# EAGLE schematic communicator_v2p1 (EAGLE 7.6.0)
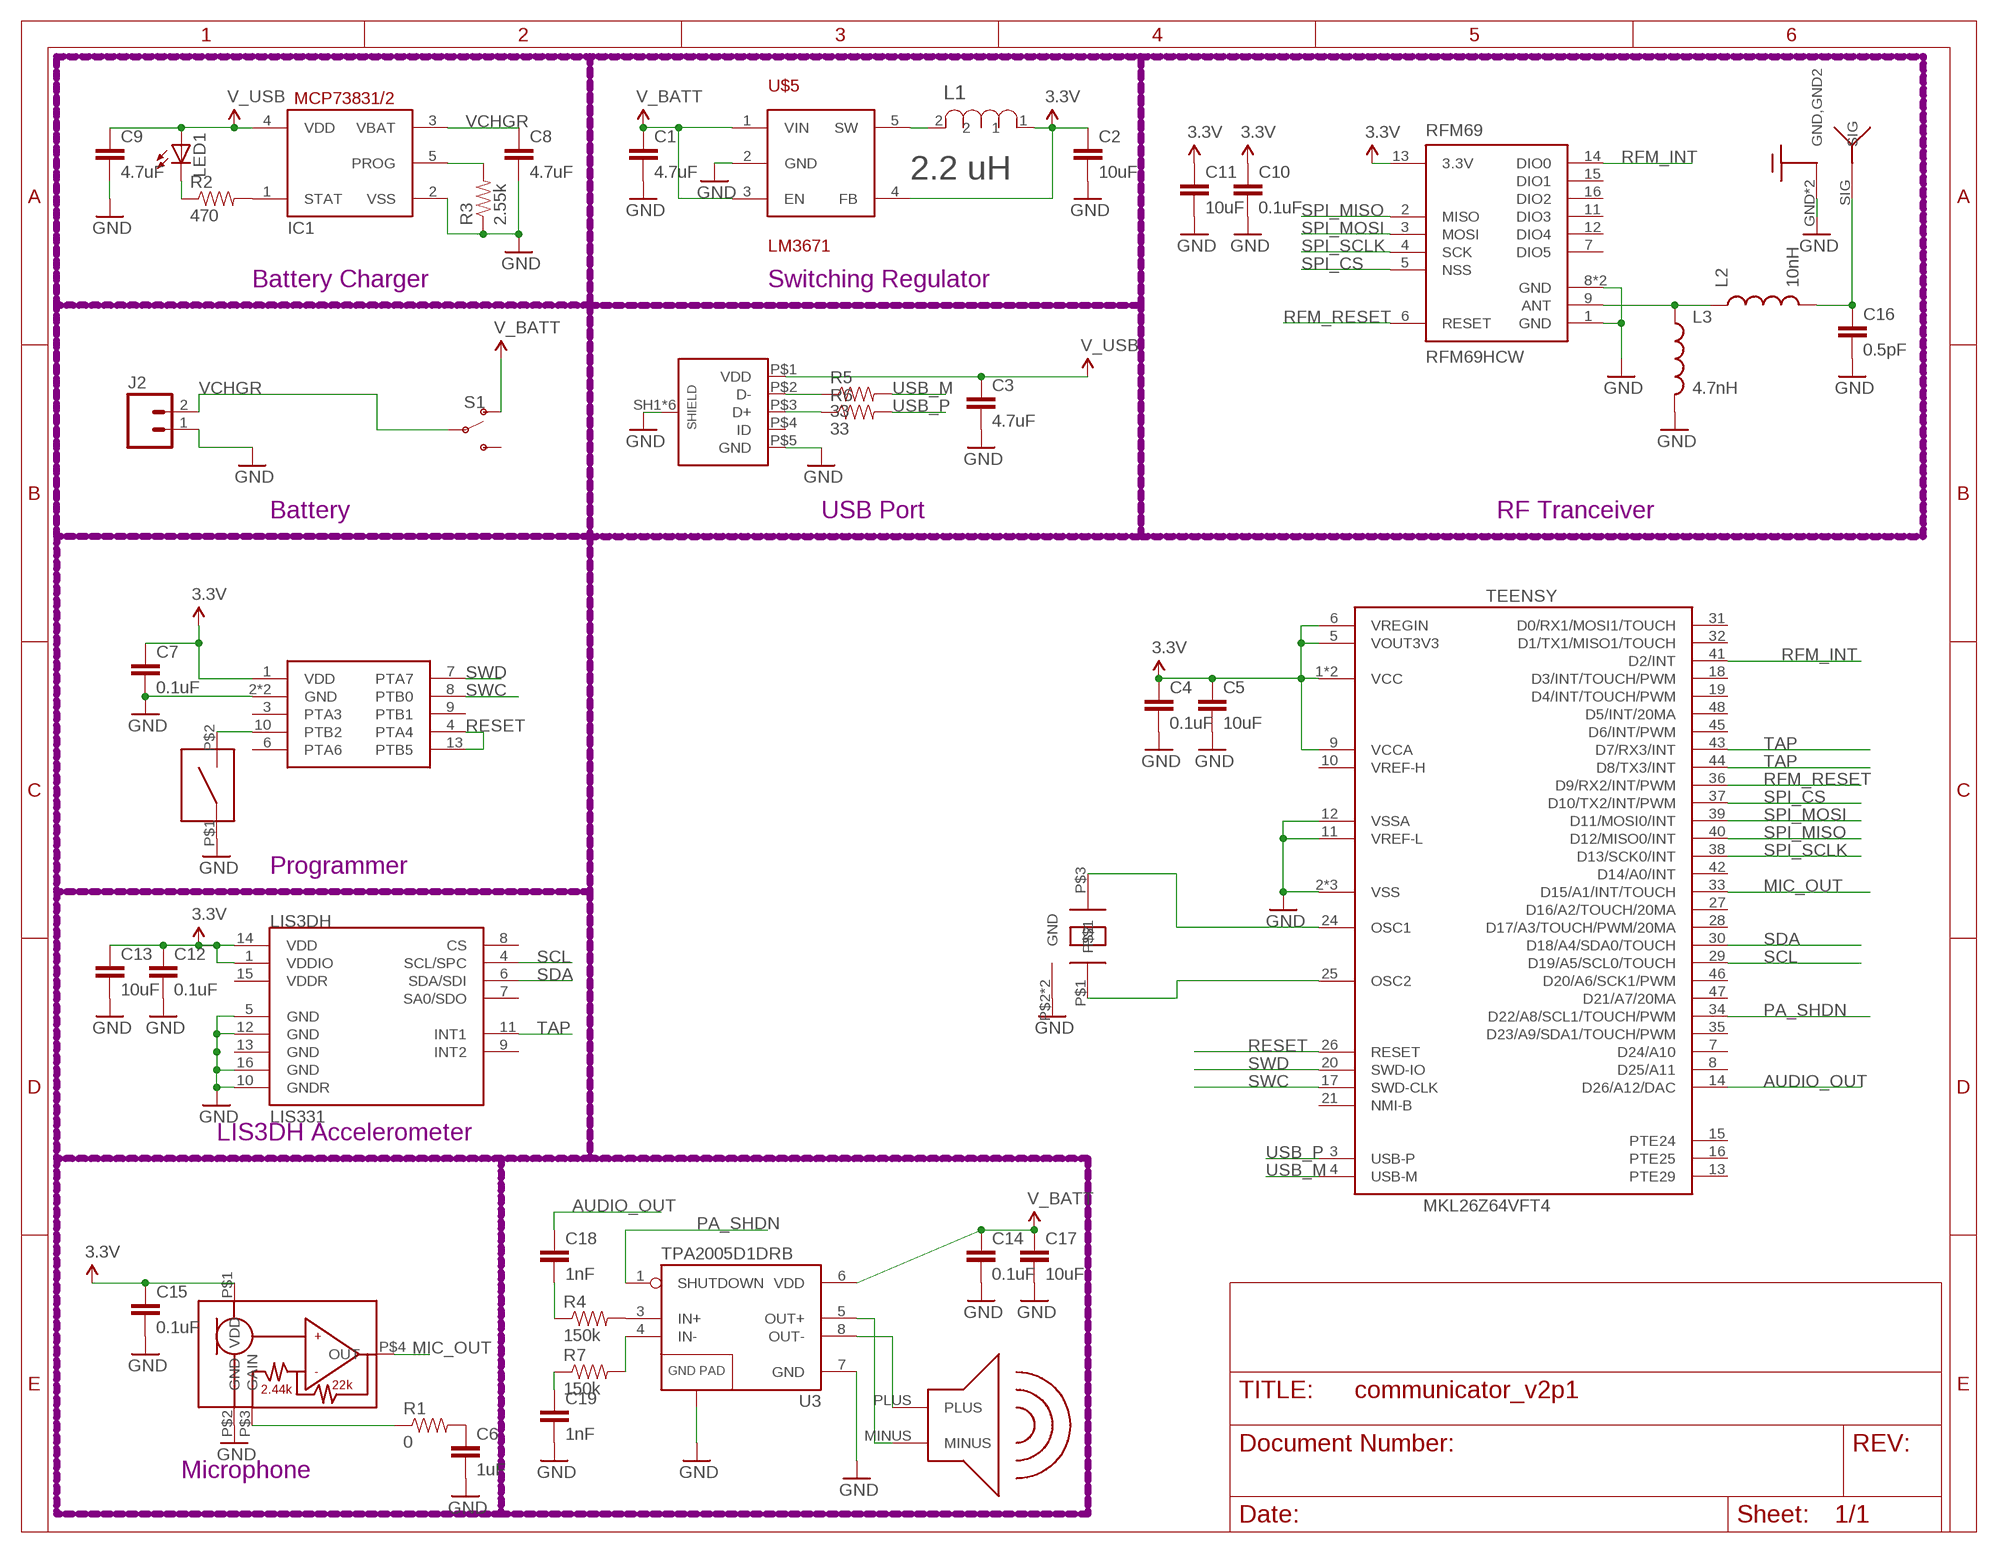
[diagram p0: schematic, sheet 1]

## Parts
3X3MM1  CURRENT_BOOTLOADER3X3MM  [QFN50P300X300X100-17N]
C1  4.7uF  0.1UF-25V(+80/-20%)(0603)  [0603-CAP]
C2  10uF  2.2UF-10V-20%(0603)  [0603-CAP]
C3  4.7uF  2.2UF-10V-20%(0603)  [0603-CAP]
C4  0.1uF  0.1UF-25V(+80/-20%)(0603)  [0603-CAP]
C5  10uF  10UF-6.3V-20%(0603)  [0603-CAP]
C6  1uF  0.1UF-25V(+80/-20%)(0603)  [0603-CAP]
C7  0.1uF  0.1UF-25V(+80/-20%)(0603)  [0603-CAP]
C8  4.7uF  4.7UF-6.3V-10%(0603)0603  [0603-CAP]
C9  4.7uF  4.7UF-6.3V-10%(0603)0603  [0603-CAP]
C10  0.1uF  0.1UF-25V(+80/-20%)(0603)  [0603-CAP]
C11  10uF  10UF-6.3V-20%(0603)  [0603-CAP]
C12  0.1uF  0.1UF-25V(+80/-20%)(0603)  [0603-CAP]
C13  10uF  10UF-6.3V-20%(0603)  [0603-CAP]
C14  0.1uF  0.1UF-25V(+80/-20%)(0603)  [0603-CAP]
C15  0.1uF  0.1UF-25V(+80/-20%)(0603)  [0603-CAP]
C16  0.5pF  0.75PF-50V(-/+.25PF)(0603)  [0603-CAP]
C17  10uF  10UF-6.3V-20%(0603)  [0603-CAP]
C18  1nF  0.1UF-25V(+80/-20%)(0603)  [0603-CAP]
C19  1nF  0.1UF-25V(+80/-20%)(0603)  [0603-CAP]
IC1  MCP73831/OT  [SOT23-5L]
J2  M02PTH  [1X02]
L1  2.2 uH  PM1210-2R2J-RC  [INDC3225X22N]
L2  10nH  INDUCTOR0603  [0603]
L3  4.7nH  INDUCTOR0603  [0603]
LED1  LEDCHIPLED_0805  [CHIPLED_0805]
LIS3DH  LIS331  [LGA16-3MM]
R1  0  33OHM1/10W1%(0603)  [0603-RES]
R2  470  470OHM1/10W1%(0603)  [0603-RES]
R3  2.55k  2.55KOHM-1/10W-1%(0603)  [0603-RES]
R4  150k  33OHM1/10W1%(0603)  [0603-RES]
R5  33  33OHM1/10W1%(0603)  [0603-RES]
R6  33  33OHM1/10W1%(0603)  [0603-RES]
R7  150k  33OHM1/10W1%(0603)  [0603-RES]
RFM69  RFM69HCW  [RFM69HCW-XXXS2]
S1  SWITCH-SPDT-SMD-RIGHT-ANGLE  [SWITCH_SPST_SMD_A]
TEENSY  MKL26Z64VFT4  [QFN50P700X700X100-49N]
U3  TPA2005D1DRB  [QFN-8_PAD]
U$1  ANTENNA_915MHZ  [ANTENNA_915MHZ]
U$2  MICROPHONE  [SPU0414HR5H-SB]
U$3  SPEAKER  [PSR1511N08S3K]
U$4  KXT131LHS  [KXT131LHS]
U$5  LM3671  [SOT23-5]
U$8  MICRO_USB_B  [MICRO_USB_B]
U$9  TSX-3225  [TSX-3225]

## Nets
3.3V: 3X3MM1.1(VDD) C2.1 C4.1 C5.1 C7.1 C10.1 C11.1 C12.1 C13.1 C15.1 L1.1 LIS3DH.1(VDDIO) LIS3DH.14(VDD) RFM69.13(3.3V) TEENSY.1(VCC) TEENSY.5(VOUT3V3) TEENSY.6(VREGIN) TEENSY.9(VCCA) TEENSY.22(VCC) U$2.P$1(VDD) U$5.4(FB)
AUDIO_OUT: C18.1 TEENSY.14(D26/A12/DAC)
GND: 3X3MM1.2(GND) 3X3MM1.17(GND) C1.2 C2.2 C3.2 C4.2 C5.2 C6.2 C7.2 C8.2 C9.2 C10.2 C11.2 C12.2 C13.2 C14.2 C15.2 C16.2 C17.2 C19.2 IC1.2(VSS) J2.1 L3.2 LIS3DH.5(GND) LIS3DH.10(GNDR) LIS3DH.12(GND) LIS3DH.16(GND) R3.1 RFM69.1(GND) RFM69.8(GND) RFM69.10(GND) TEENSY.2(VSS) TEENSY.11(VREF-L) TEENSY.12(VSSA) TEENSY.23(VSS) TEENSY.49(VSS) U3.7(GND) U3.9(GND) U3.10(GND) U3.11(GND) U3.12(GND) U3.13(GND) U$1.GND2(GND,GND2) U$1.GND(GND,GND2) U$2.P$2(GND) U$4.P$1 U$5.2(GND) U$8.P$5(GND) U$8.SH1(SHIELD) U$8.SH2(SHIELD) U$8.SH3(SHIELD) U$8.SH4(SHIELD) U$8.SH5(SHIELD) U$8.SH6(SHIELD) U$9.P$2(GND) U$9.P$4(GND)
MIC_OUT: TEENSY.33(D15/A1/INT/TOUCH) U$2.P$4(OUT)
N$1: R1.1 U$2.P$3(GAIN)
N$2: IC1.1(STAT) R2.2
N$3: C6.1 R1.2
N$4: C16.1 L2.2 U$1.SIG
N$5: TEENSY.24(OSC1) U$9.P$3
N$6: TEENSY.25(OSC2) U$9.P$1
N$7: U3.5(OUT+) U$3.MINUS
N$8: L2.1 L3.1 RFM69.9(ANT)
N$9: 3X3MM1.10(PTB2) U$4.P$2
N$10: U3.8(OUT-) U$3.PLUS
N$11: R4.2 U3.3(IN+)
N$12: R7.2 U3.4(IN-)
N$13: C18.2 R4.1
N$14: R5.1 U$8.P$2(D-)
N$15: R6.1 U$8.P$3(D+)
N$16: C19.1 R7.1
N$21: IC1.5(PROG) R3.2
N$25: LED1.C R2.1
N$31: L1.2 U$5.5(SW)
PA_SHDN: TEENSY.34(D22/A8/SCL1/TOUCH/PWM) U3.1(SHUTDOWN)
RESET: 3X3MM1.4(PTA4) 3X3MM1.13(PTB5) TEENSY.26(RESET)
RFM_INT: RFM69.14(DIO0) TEENSY.41(D2/INT)
RFM_RESET: RFM69.6(RESET) TEENSY.36(D9/RX2/INT/PWM)
SCL: LIS3DH.4(SCL/SPC) TEENSY.29(D19/A5/SCL0/TOUCH)
SDA: LIS3DH.6(SDA/SDI) TEENSY.30(D18/A4/SDA0/TOUCH)
SPI_CS: RFM69.5(NSS) TEENSY.37(D10/TX2/INT/PWM)
SPI_MISO: RFM69.2(MISO) TEENSY.40(D12/MISO0/INT)
SPI_MOSI: RFM69.3(MOSI) TEENSY.39(D11/MOSI0/INT)
SPI_SCLK: RFM69.4(SCK) TEENSY.38(D13/SCK0/INT)
SWC: 3X3MM1.8(PTB0) TEENSY.17(SWD-CLK)
SWD: 3X3MM1.7(PTA7) TEENSY.20(SWD-IO)
TAP: LIS3DH.11(INT1) TEENSY.43(D7/RX3/INT) TEENSY.44(D8/TX3/INT)
USB_M: R5.2 TEENSY.4(USB-M)
USB_P: R6.2 TEENSY.3(USB-P)
V_BATT: C1.1 C14.1 C17.1 S1.1(O) U3.6(VDD) U$5.1(VIN) U$5.3(EN)
V_USB: C3.1 C9.1 IC1.4(VDD) LED1.A U$8.P$1(VDD)
VCHGR: C8.1 IC1.3(VBAT) J2.2 S1.2(P)
Unconnected: 3X3MM1.3(PTA3) 3X3MM1.6(PTA6) 3X3MM1.9(PTB1) LIS3DH.7(SA0/SDO) LIS3DH.8(CS) LIS3DH.9(INT2) LIS3DH.13(GND) LIS3DH.15(VDDR) RFM69.7(DIO5) RFM69.11(DIO3) RFM69.12(DIO4) RFM69.15(DIO1) RFM69.16(DIO2) S1.3(S) TEENSY.7(D24/A10) TEENSY.8(D25/A11) TEENSY.10(VREF-H) TEENSY.13(PTE29) TEENSY.15(PTE24) TEENSY.16(PTE25) TEENSY.18(D3/INT/TOUCH/PWM) TEENSY.19(D4/INT/TOUCH/PWM) TEENSY.21(NMI-B) TEENSY.27(D16/A2/TOUCH/20MA) TEENSY.28(D17/A3/TOUCH/PWM/20MA) TEENSY.31(D0/RX1/MOSI1/TOUCH) TEENSY.32(D1/TX1/MISO1/TOUCH) TEENSY.35(D23/A9/SDA1/TOUCH/PWM) TEENSY.42(D14/A0/INT) TEENSY.45(D6/INT/PWM) TEENSY.46(D20/A6/SCK1/PWM) TEENSY.47(D21/A7/20MA) TEENSY.48(D5/INT/20MA) U$8.P$4(ID)

## Notes on the sheet
- Battery Charger | Switching Regulator
- Battery | USB Port | RF Tranceiver
- Programmer
- LIS3DH Accelerometer
- Microphone

## Library data of the parts
3X3MM1 = Teensy_DIY_v1.0:CURRENT_BOOTLOADER: MKL02Z32 and MKL04Z32 bootloader chips for Teensy LC (MKL26) and Teensy 3.2 (MKL20D256) processors. Remember, all power supply pins need to be decoupled! Also note the connections that Paul recommends on his bootloader page.
C1 C6 C18 C19 = SparkFun-Capacitors:0.1UF-25V(+80/-20%)(0603): CAP-00810 Ceramic Standard decoupling cap; PROD_ID: CAP-00810; VALUE: 0.1uF
C2 C3 = SparkFun-Capacitors:2.2UF-10V-20%(0603): CAP-07888; PROD_ID: CAP-07888; VALUE: 2.2uF
C4 C7 C10 C12 C14 C15 = SparkFun-Capacitors:0.1UF-25V(+80/-20%)(0603): CAP-00810 Ceramic Standard decoupling cap; PROD_ID: CAP-00810
C5 C11 C13 C17 = SparkFun-Capacitors:10UF-6.3V-20%(0603): CAP-11015; PROD_ID: CAP-11015
C8 C9 = SparkFun-Capacitors:4.7UF-6.3V-10%(0603): CAP-08280; PROD_ID: CAP-08280
C16 = SparkFun-Capacitors:0.75PF-50V(-/+.25PF)(0603): CAP-07878; PROD_ID: CAP-07878; VALUE: 0.75pF
IC1 = adafruit:MCP73831: MCP73831/2 Miniature Single-Cell, Fully Integrated Li-Ion, Li-Polymer Charge Management Controllers. Nice and small simple lipoly charge controller, with adjustable current and status output (LED) http://www.ladyada.net/library/pcb/eaglelibrary.html
J2 = SparkFun-Connectors:M02: Standard 2-pin 0.1" header. Use with - straight break away headers ( PRT-00116) - right angle break away headers (PRT-00553) - swiss pins (PRT-00743) - machine pins (PRT-00117) - female headers (PRT-00115) Molex polarized connector foot print use with: PRT-08233 with associated crimp pins and housings. 2.54_SCREWTERM for use with PRT-10571. 3.5mm Screw Terminal footprints for PRT-08084 5mm Screw Terminal footprints for use with PRT-08432
L1 = Bourns_By_element14_Batch_1:PM1210-2R2J-RC: CHIP INDUCTOR, 2.2UH 320MA 5% 75MHZ; MPN: PM1210-2R2J-RC; OC_FARNELL: 1180471; OC_NEWARK: 63K3102; SUPPLIER: BOURNS; TOLERANCE: ±5 %
L2 L3 = SparkFun-Passives:INDUCTOR: Inductors Basic Inductor/Choke - 0603 and 1206. Footprints are not proven and vary greatly between part numbers. INDUCTOR POWER 3.3UH 4.0A SMD 0.197" L x 0.197" W x 0.177" H (5.00mm x 5.00mm x 4.50mm)
LED1 = adafruit:LED: LED OSRAM: - CHIPLED LG R971, LG N971, LY N971, LG Q971, LY Q971, LO R971, LY R971 LH N974, LH R974 LS Q976, LO Q976, LY Q976 LO Q996 - Hyper CHIPLED LW Q18S LB Q993, LB Q99A, LB R99A - SideLED LS A670, LO A670, LY A670, LG A670, LP A670 LB A673, LV A673, LT A673, LW A673 LH A674 LY A675 LS A676, LA A676, LO A676, LY A676, LW A676 LS A679, LY A679, LG A679 - Hyper Micro SIDELED® LS Y876, LA Y876, LO Y876, LY Y876 LT Y87S - SmartLED LW L88C, LW L88S LB L89C, LB L89S, LG L890 LS L89K, LO L89K, LY L89K LS L896, LA L896, LO L896, LY L896 - TOPLED LS T670, LO T670, LY T670, LG T670, LP T670 LSG T670, LSP T670, LSY T670, LOP T670, LYG T670 LG T671, LOG T671, LSG T671 LB T673, LV T673, LT T673, LW T673 LH T674 LS T676, LA T676, LO T676, LY T676, LB T676, LH T676, LSB T676, LW T676 LB T67C, LV T67C, LT T67C, LS T67K, LO T67K, LY T67K, LW E67C LS E67B, LA E67B, LO E67B, LY E67B, LB E67C, LV E67C, LT E67C LW T67C LS T679, LY T679, LG T679 LS T770, LO T770, LY T770, LG T770, LP T770 LB T773, LV T773, LT T773, LW T773 LH T774 LS E675, LA E675, LY E675, LS T675 LS T776, LA T776, LO T776, LY T776, LB T776 LHGB T686 LT T68C, LB T68C - Hyper Mini TOPLED® LB M676 - Mini TOPLED Santana® LG M470 LS M47K, LO M47K, LY M47K Source: http://www.osram.convergy.de/
LIS3DH = SparkFun-Sensors:LIS331: 3-axis 6/12/24g SPI/I2C accelerometer
R1 R4 R7 = SparkFun-Resistors:33OHM1/10W1%(0603): RES-08270; PROD_ID: RES-08270; VALUE: 33
R2 = SparkFun-Resistors:470OHM1/10W1%(0603): RES-07869; PROD_ID: RES-07869
R3 = SparkFun-Resistors:2.55KOHM-1/10W-1%(0603): RES-11227; PROD_ID: RES-11227
R5 R6 = SparkFun-Resistors:33OHM1/10W1%(0603): RES-08270; PROD_ID: RES-08270
RFM69 = SparkFun-RF:RFM69H; PROD_ID: IC-11997, IC-12053
S1 = SparkFun-Switches:SWITCH-SPDT: Single Pole, Double Throw (SPDT) Switch Single-pole, double-throw (SPDT) switch. Variant Overview SMD-AYZ0202 Surface Mount DPDT Switch <https://www.sparkfun.com/products/597> (COM-00597) Used on e.g. LilyPad Arduino USB - ATmega32U4 Board <https://www.sparkfun.com/products/12049> PTH-11.6X4.0MM SPDT Mini Power Switch <https://www.sparkfun.com/products/102> (COM-00102) Used on e.g. SparkFun Simon Says - Through-Hole Soldering Kit <https://www.sparkfun.com/products/10547> (KIT-10547) PTH-11.6X4.0MM-KIT KIT version of SPDT Mini Power Switch - Simplifies soldering by removing tStop of switch pins - only one side can be soldered. PTH-11.6X4.0MM-LOCK LOCK version of SPDT Mini Power Switch - Offset pins hold switch in place for easier soldering. SMD-RIGHT-ANGLE Surface Mount Right Angle Switch <https://www.sparkfun.com/products/10860> (COM-10860) Used on e.g. SparkFun ESP8266 Thing <https://www.sparkfun.com/products/13231>; PROD_ID: SWCH-10651; SF_SKU: COM-10860
TEENSY = Teensy_DIY_v1.0:MKL26Z64VFT4: This is a Teensy LC MCU based on the MKL26Z64VFT4. Note: To enable USB, you need to have 3.3V at VOUT3V3. If you want to supply 3.3V power externally, provide it to VCC, VREGIN, and VOUT3V3. The Voltage Regulator will go into dropout mode.
U3 = SparkFun-AnalogIC:TPA2005D1: 1.4W MONO CLASS-D AUDIO POWER AMPLIFIER The TPA2005D1 is a 1.4-W high efficiency filter-free class-D audio power amplifier in a BGA, QFN, or MSOP package that requires only three external components. Datasheet: http://focus.ti.com/lit/ds/symlink/tpa2005d1.pdf 1.4 W Into 8 ? From a 5V Supply at THD = 10% (Typ) Maximum Battery Life and Minimum Heat Efficiency With an 8-? Speaker: 84% at 400 mW, 79% at 100 mW 2.8-mA Quiescent Current 0.5-mA Shutdown Current Ideal for Wireless or Cellular Handsets and PDAs Capable of Driving an 8-? Speaker (2.5 V ? VDD ? 5.5 V) and a 4-? Speaker (2.5 V ? VDD ? 4.2 V) Only Three External Components Optimized PWM Output Stage Eliminates LC Output Filter Internally Generated 250-kHz Switching Frequency Eliminates Capacitor and Resistor Improved PSRR (-71 dB at 217 Hz) and Wide Supply Voltage (2.5 V to 5.5 V) Eliminates Need for a Voltage Regulator Fully Differential Design Reduces RF Rectification and Eliminates Bypass Capacitor Improved CMRR Eliminates Two Input Coupling Capacitors
U$1 = prototype:ANTENNA_915MHZ
U$2 = prototype:MICROPHONE
U$3 = prototype:SPEAKER
U$4 = prototype:KXT131LHS
U$5 = texas-custom:LM3671: Texas Instruments LM3671, LM3671Q 2MHz, 600mA Step-Down DC-DC Converter
U$8 = prototype:MICRO_USB_B
U$9 = prototype:TSX-3225